# EasyEDA schematic Soccer Esp32.json
TITLE: Sheet_1; REV: 1.0; Date: 2025-09-30; Sheet: 1/1; Company: Your Company
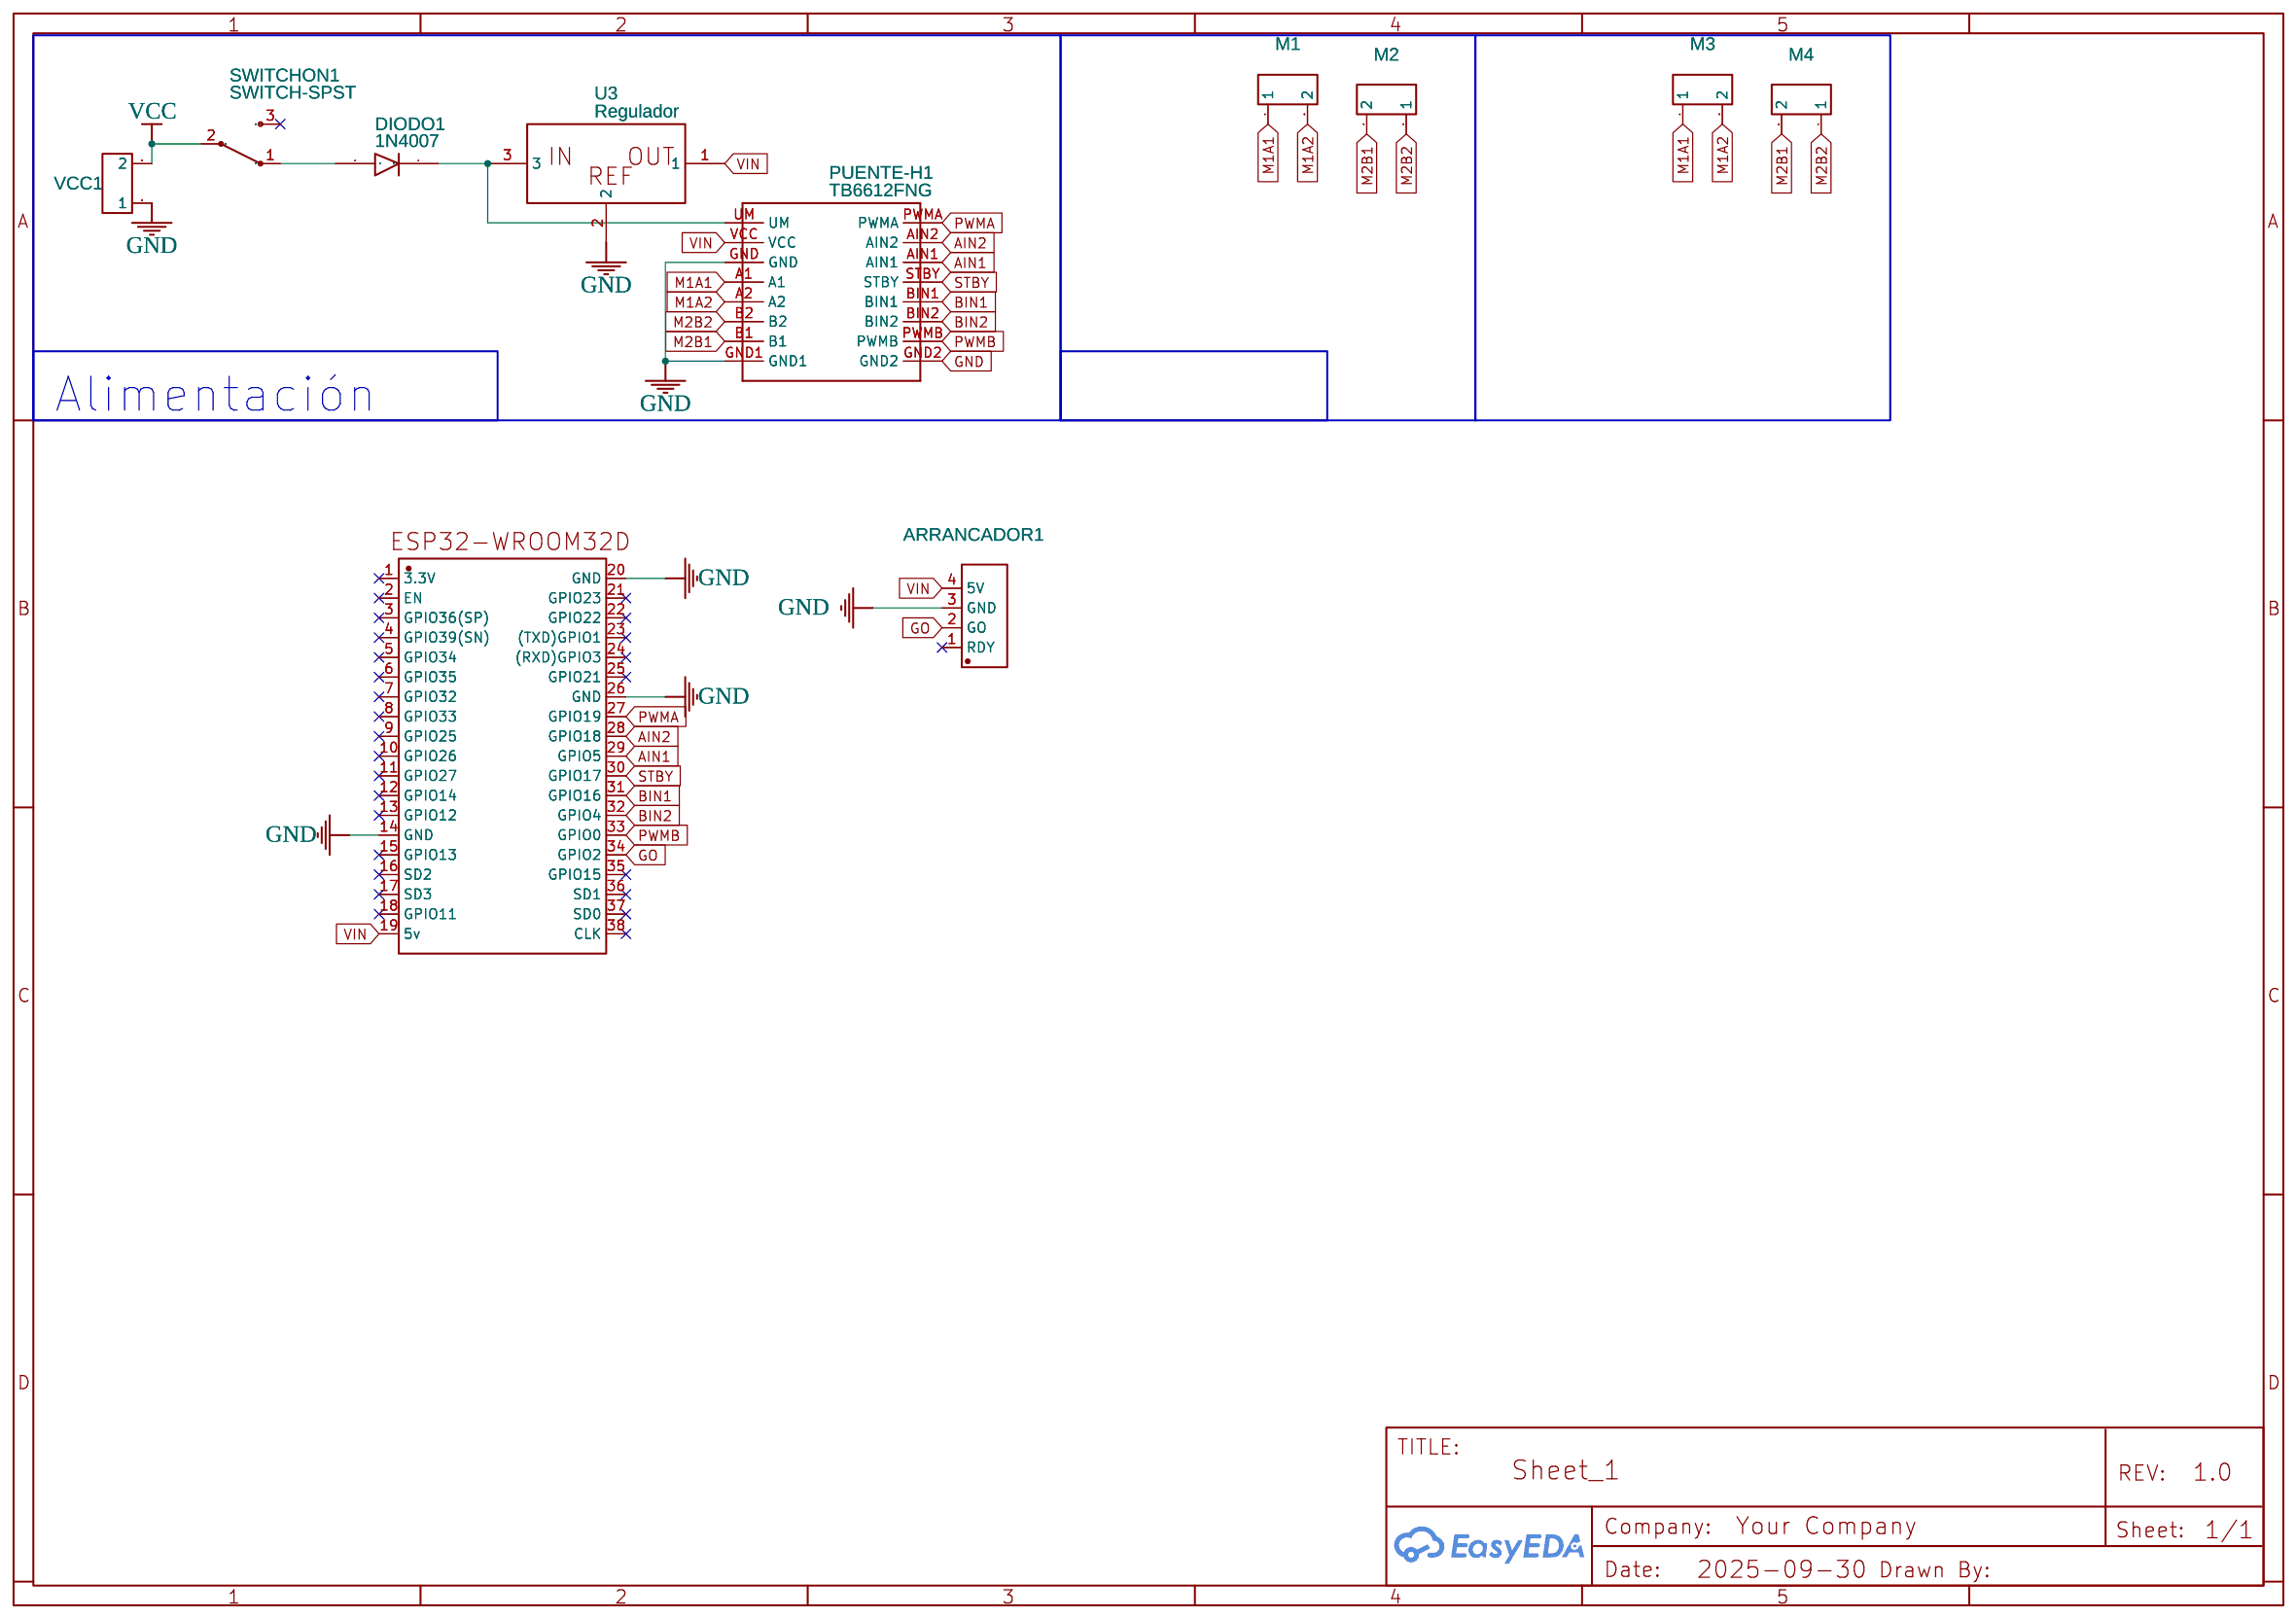
[diagram p0: schematic sheet]

## Parts
ARRANCADOR1  HEADER 1X4P COPY  [HEADER - HEADER-FEMALE-2.54_1X4]
DIODO1  1N4007  [DIODO1N4004]
M1  CONNECTOR 2 PINS  [CONNECTOR_PINHEADER_2.54MM:PINHEADER_1X11_P_2.54MM]
M2  CONNECTOR 2 PINS  [CONNECTOR_PINHEADER_2.54MM:PINHEADER_1X11_P_2.54MM]
M3  CONNECTOR 2 PINS  [CONNECTOR_PINHEADER_2.54MM:PINHEADER_1X11_P_2.54MM]
M4  CONNECTOR 2 PINS  [CONNECTOR_PINHEADER_2.54MM:PINHEADER_1X11_P_2.54MM]
PUENTE-H1  TB6612FNG  [TB6612FNG]
SWITCHON1  SWITCH-SPST  [SWITCH-SPST]
U1  ESP32WRoom32D  [ESP32WROOM32D]
U3  Regulador  [REGULADOR]
VCC1  CONNECTOR 2 PINS  [CONNECTOR_PINHEADER_2.54MM:PINHEADER_1X11_P_2.54MM]

## Library data of the parts
ARRANCADOR1 = HEADER 1X4P COPY: Contributor: trananhkha2406; Supplier: Sparkfun
DIODO1 = 1N4007: Contributor: adriancp
M1-M4 VCC1 = HEADER PAD 2X: Manufacturer: BOOMELE; Manufacturer Part: Female headerHDR1X8-2.54; Supplier Part: C27438; JLCPCB Part Class: Extended Part; Contributor: papisdieng22
PUENTE-H1 = TB6612FNG: Contributor: 3D Mr.
SWITCHON1 = SWITCH-SPST: sourceId: ceKgMGAuL; Contributor: Sascha Dahten
U1 = ESP32WRoom32D: catid: 20; Contributor: saam.ruiz; Manufacturer Part: ESp32 38pin; sim: true
U3 = Regulador: Contributor: miguelcrego

## Nets
GND: ARRANCADOR1.3(GND) PUENTE-H1.GND PUENTE-H1.GND1 PUENTE-H1.GND2 U1.14(GND) U1.20(GND) U1.26(GND) U3.2 VCC1.1
VCC: SWITCHON1.2 VCC1.2
VIN: ARRANCADOR1.4(5V) PUENTE-H1.VCC U1.19(5v) U3.1
AIN1: PUENTE-H1.AIN1 U1.29(GPIO5)
AIN2: PUENTE-H1.AIN2 U1.28(GPIO18)
BIN1: PUENTE-H1.BIN1 U1.31(GPIO16)
BIN2: PUENTE-H1.BIN2 U1.32(GPIO4)
GO: ARRANCADOR1.2(GO) U1.34(GPIO2)
M1A1: M1.1 M3.1 PUENTE-H1.A1
M1A2: M1.2 M3.2 PUENTE-H1.A2
M2B1: M2.2 M4.2 PUENTE-H1.B1
M2B2: M2.1 M4.1 PUENTE-H1.B2
PWMA: PUENTE-H1.PWMA U1.27(GPIO19)
PWMB: PUENTE-H1.PWMB U1.33(GPIO0)
STBY: PUENTE-H1.STBY U1.30(GPIO17)
Net-(DIODO1-1): DIODO1.1 PUENTE-H1.UM U3.3
Net-(DIODO1-2): DIODO1.2 SWITCHON1.1

Not connected (* = marked no-connect by the designer): ARRANCADOR1 1(RDY)*; SWITCHON1 3*; U1 1(3.3V)* 2(EN)* 3(GPIO36(SP))* 4(GPIO39(SN))* 5(GPIO34)* 6(GPIO35)* 7(GPIO32)* 8(GPIO33)* 9(GPIO25)* 10(GPIO26)* 11(GPIO27)* 12(GPIO14)* 13(GPIO12)* 15(GPIO13)* 16(SD2)* 17(SD3)* 18(GPIO11)* 21(GPIO23)* 22(GPIO22)* 23((TXD)GPIO1)* 24((RXD)GPIO3)* 25(GPIO21)* 35(GPIO15)* 36(SD1)* 37(SD0)* 38(CLK)*

## Notes on the sheet
- Alimentación
